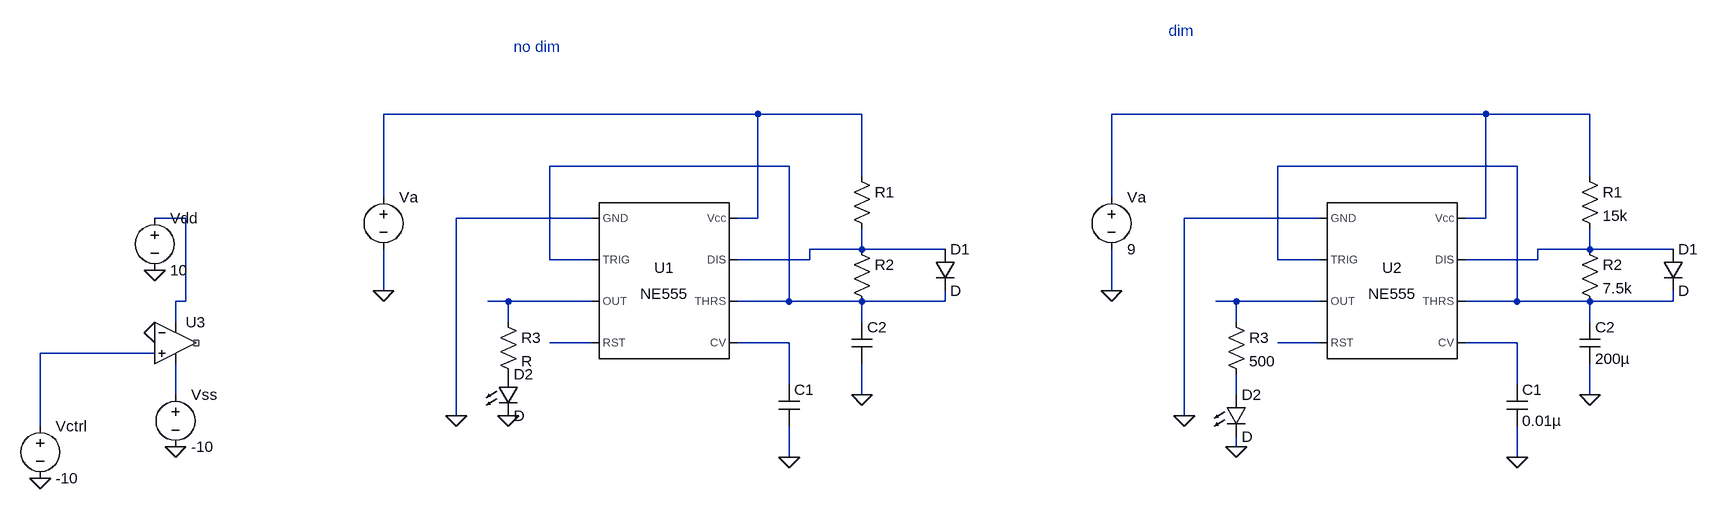
[diagram p0: schematic progetto_timer555.asc]
progetto_timer555.asc, the LTspice schematic file:
Version 4
SHEET 1 1884 680
WIRE 432 -208 -144 -208
WIRE 592 -208 432 -208
WIRE 1552 -208 976 -208
WIRE 1712 -208 1552 -208
WIRE 480 -128 112 -128
WIRE 1600 -128 1232 -128
WIRE 592 -112 592 -208
WIRE 1712 -112 1712 -208
WIRE -144 -80 -144 -208
WIRE 976 -80 976 -208
WIRE -448 -48 -496 -48
WIRE 176 -48 -32 -48
WIRE 432 -48 432 -208
WIRE 432 -48 400 -48
WIRE 1296 -48 1088 -48
WIRE 1552 -48 1552 -208
WIRE 1552 -48 1520 -48
WIRE 592 0 592 -32
WIRE 592 0 512 0
WIRE 720 0 592 0
WIRE 1712 0 1712 -32
WIRE 1712 0 1632 0
WIRE 1840 0 1712 0
WIRE 112 16 112 -128
WIRE 176 16 112 16
WIRE 512 16 512 0
WIRE 512 16 400 16
WIRE 1232 16 1232 -128
WIRE 1296 16 1232 16
WIRE 1632 16 1632 0
WIRE 1632 16 1520 16
WIRE -144 64 -144 0
WIRE 976 64 976 0
WIRE -448 80 -448 -48
WIRE -448 80 -464 80
WIRE 48 80 16 80
WIRE 176 80 48 80
WIRE 480 80 480 -128
WIRE 480 80 400 80
WIRE 592 80 480 80
WIRE 720 80 720 64
WIRE 720 80 592 80
WIRE 1168 80 1136 80
WIRE 1296 80 1168 80
WIRE 1600 80 1600 -128
WIRE 1600 80 1520 80
WIRE 1712 80 1600 80
WIRE 1840 80 1840 64
WIRE 1840 80 1712 80
WIRE -464 112 -464 80
WIRE 48 112 48 80
WIRE 592 112 592 80
WIRE 1168 112 1168 80
WIRE 1712 112 1712 80
WIRE 176 144 112 144
WIRE 480 144 400 144
WIRE 1296 144 1232 144
WIRE 1600 144 1520 144
WIRE -496 160 -672 160
WIRE 480 208 480 144
WIRE 1600 208 1600 144
WIRE -464 224 -464 176
WIRE 592 224 592 176
WIRE 1168 224 1168 192
WIRE 1712 224 1712 176
WIRE -32 256 -32 -48
WIRE 1088 256 1088 -48
WIRE -672 272 -672 160
WIRE 1168 304 1168 288
WIRE 480 320 480 272
WIRE 1600 320 1600 272
FLAG -32 256 0
FLAG -144 64 0
FLAG 480 320 0
FLAG 592 224 0
FLAG -672 352 0
FLAG -464 304 0
FLAG -496 32 0
FLAG -496 128 0
FLAG 48 256 0
FLAG 1088 256 0
FLAG 976 64 0
FLAG 1600 320 0
FLAG 1712 224 0
FLAG 1168 304 0
SYMBOL Misc\\NE555 288 48 R0
SYMATTR InstName U1
SYMBOL voltage -144 -96 R0
WINDOW 123 0 0 Left 0
WINDOW 39 0 0 Left 0
SYMATTR InstName Va
SYMATTR Value ""
SYMBOL cap 464 208 R0
SYMATTR InstName C1
SYMATTR Value ""
SYMBOL res 576 -16 R0
SYMATTR InstName R2
SYMATTR Value ""
SYMBOL res 576 -128 R0
SYMATTR InstName R1
SYMATTR Value ""
SYMBOL cap 576 112 R0
SYMATTR InstName C2
SYMATTR Value ""
SYMBOL diode 704 0 R0
SYMATTR InstName D1
SYMBOL voltage -672 256 R0
WINDOW 123 0 0 Left 0
WINDOW 39 0 0 Left 0
SYMATTR InstName Vctrl
SYMATTR Value -10
SYMBOL voltage -496 -64 R0
WINDOW 123 0 0 Left 0
WINDOW 39 0 0 Left 0
SYMATTR InstName Vdd
SYMATTR Value 10
SYMBOL voltage -464 208 R0
WINDOW 123 0 0 Left 0
WINDOW 39 0 0 Left 0
SYMATTR InstName Vss
SYMATTR Value -10
SYMBOL OpAmps\\UniversalOpAmp2 -464 144 R0
SYMATTR InstName U3
SYMBOL res 32 96 R0
SYMATTR InstName R3
SYMBOL LED 32 192 R0
SYMATTR InstName D2
SYMBOL Misc\\NE555 1408 48 R0
SYMATTR InstName U2
SYMBOL voltage 976 -96 R0
WINDOW 123 0 0 Left 0
WINDOW 39 0 0 Left 0
SYMATTR InstName Va
SYMATTR Value 9
SYMBOL cap 1584 208 R0
SYMATTR InstName C1
SYMATTR Value 0.01µ
SYMBOL res 1696 -16 R0
SYMATTR InstName R2
SYMATTR Value 7.5k
SYMBOL res 1696 -128 R0
SYMATTR InstName R1
SYMATTR Value 15k
SYMBOL cap 1696 112 R0
SYMATTR InstName C2
SYMATTR Value 200µ
SYMBOL diode 1824 0 R0
SYMATTR InstName D1
SYMBOL res 1152 96 R0
SYMATTR InstName R3
SYMATTR Value 500
SYMBOL LED 1152 224 R0
SYMATTR InstName D2
TEXT 56 -312 Left 2 ;no dim
TEXT 1064 -336 Left 2 ;dim

The netlist it stands for:
* progetto_timer555.asc
XU1 0 N003 N008 N010 N011 N003 N006 N001 NE555  ; pins GND TRIG OUT RST CV THRS DIS Vcc
Va N001 0
C1 N011 0
R2 N006 N003
R1 N001 N006
C2 N003 0
D1 N006 N003 D
Vctrl N014 0 -10
Vdd N005 0 10
Vss N015 0 -10
XU3 N014 0 N005 N015 NC_01 level2 Avol=1Meg GBW=10Meg Slew=10Meg Ilimit=25m Rail=0 Vos=0 En=0 Enk=0 In=0 Ink=0 Rin=500Meg  ; pins In+ In- V+ V- OUT
R3 N008 P001 R
D2 P001 0 D
XU2 0 N004 N009 N012 N013 N004 N007 N002 NE555  ; pins GND TRIG OUT RST CV THRS DIS Vcc
Va N002 0 9
C1 N013 0 0.01µ
R2 N007 N004 7.5k
R1 N002 N007 15k
C2 N004 0 200µ
D1 N007 N004 D
R3 N009 N016 500
D2 N016 0 D
.model D D
.lib standard.dio
* no dim
* dim
.lib NE555.sub
.lib UniversalOpAmp2.lib
.backanno
.end